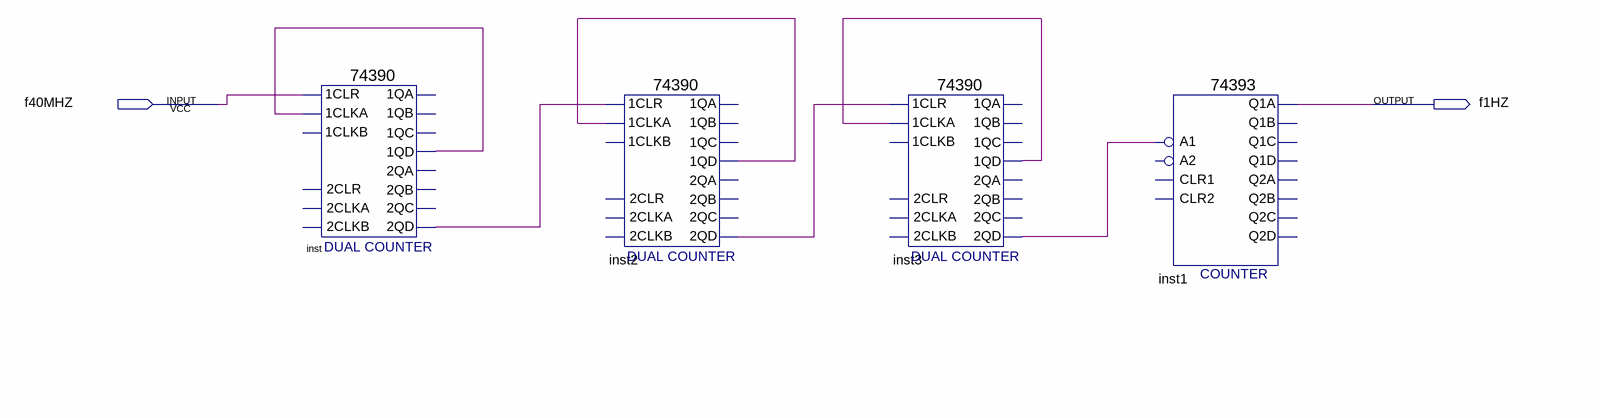
[diagram p0: schematic sheet]
// Quartus schematic 1210.bdf as structural Verilog: 4 symbols, 2 pins
module \1210  (
  input  f40MHZ,
  output f1HZ
);

  wire inst2_1qd, inst2_2qd, inst3_1qd, inst3_2qd, inst_1qd, inst_2qd;

  \74390  inst (
    .\1CLR (f40MHZ), .\1CLKA (inst_1qd), .\1QD (inst_1qd), .\2QD (inst_2qd));  // open: 2CLKA, 2CLR, 2CLKB, 1CLKB, 1QA, 1QB, 1QC, 2QA, 2QB, 2QC
  \74390  inst2 (
    .\1CLR (inst_2qd), .\1CLKA (inst2_1qd), .\1QD (inst2_1qd), .\2QD (inst2_2qd));  // open: 2CLKA, 2CLR, 2CLKB, 1CLKB, 1QA, 1QB, 1QC, 2QA, 2QB, 2QC
  \74390  inst3 (
    .\1CLR (inst2_2qd), .\1CLKA (inst3_1qd), .\1QD (inst3_1qd), .\2QD (inst3_2qd));  // open: 2CLKA, 2CLR, 2CLKB, 1CLKB, 1QA, 1QB, 1QC, 2QA, 2QB, 2QC
  \74393  inst1 (.A1(inst3_2qd), .Q1A(f1HZ));  // open: CLR1, A2, CLR2, Q2D, Q2C, Q2B, Q1C, Q1D, Q2A, Q1B
endmodule
